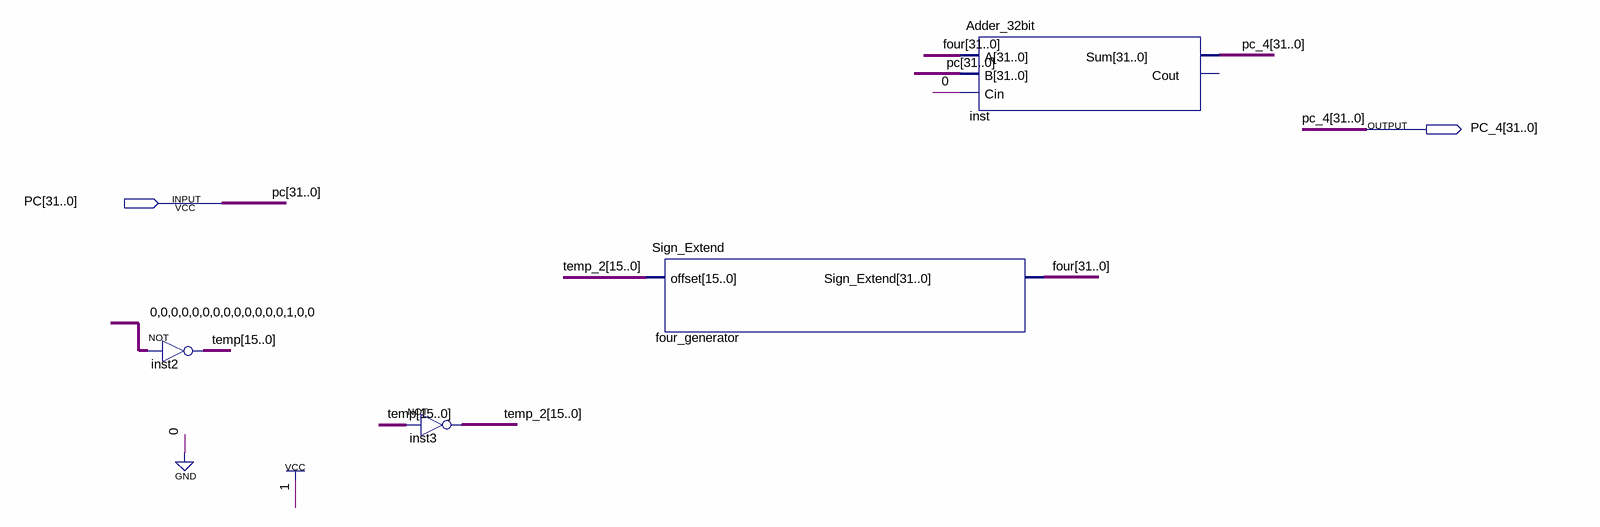
[diagram p0: schematic sheet]
// Quartus schematic pc_plus_4.bdf as structural Verilog: 4 symbols, 2 pins
module pc_plus_4 (
  input  [31:0] PC,
  output [31:0] PC_4
);

  wire [15:0] temp, temp_2;
  wire [31:0] four;

  assign temp = ~16'b0000000000000100;  // NOT inst2, 16 bits wide
  assign temp_2 = ~temp;  // NOT inst3, 16 bits wide
  Sign_Extend four_generator (.offset(temp_2), .Sign_Extend(four));
  Adder_32bit inst (.A(four), .B(PC), .Cin(1'b0), .Sum(PC_4));  // open: Cout
endmodule
